# EAGLE design hall_sensor (EAGLE 7.5.0)
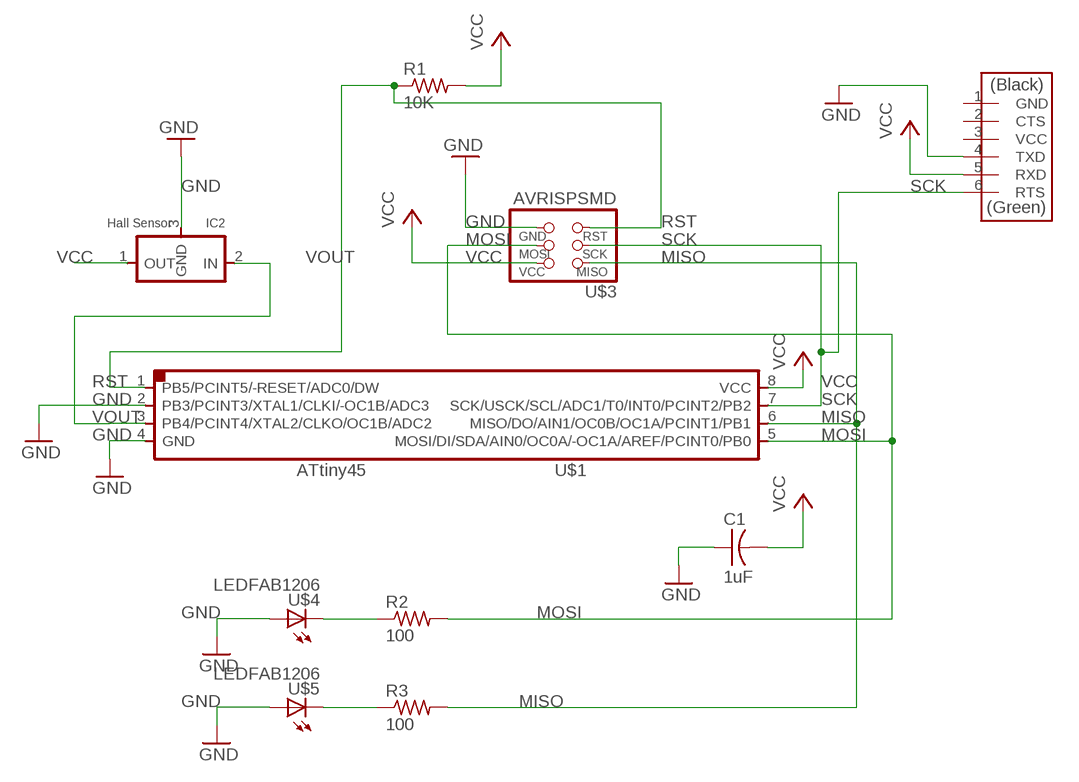
[diagram p0: schematic, sheet 1]

## Parts
C1  1uF  CAP-US1206FAB  [C1206FAB]
IC2  Hall Sensor  REGULATORSOT23  [SOT23]
R1  10K  RES-US1206FAB  [R1206FAB]
R2  100  RES-US1206FAB  [R1206FAB]
R3  100  RES-US1206FAB  [R1206FAB]
U$1  ATTINY45SI  [SOIC8]
U$2  FTDI-SMD-HEADER  [1X06SMD]
U$3  AVRISPSMD  [2X03SMD]
U$4  LEDFAB1206  [LED1206FAB]
U$5  LEDFAB1206  [LED1206FAB]

## Nets
GND: C1.1 IC2.3(GND) U$1.2(PB3/PCINT3/XTAL1/CLKI/-OC1B/ADC3) U$1.4(GND) U$2.4(TXD) U$3.6(GND) U$4.1(A) U$5.1(A)
MISO: R3.2 U$1.6(MISO/DO/AIN1/OC0B/OC1A/PCINT1/PB1) U$3.1(MISO)
MOSI: R2.2 U$1.5(MOSI/DI/SDA/AIN0/OC0A/-OC1A/AREF/PCINT0/PB0) U$3.4(MOSI)
N$1: R2.1 U$4.2(C)
N$2: R3.1 U$5.2(C)
RST: R1.1 U$1.1(PB5/PCINT5/-RESET/ADC0/DW) U$3.5(RST)
SCK: U$1.7(SCK/USCK/SCL/ADC1/T0/INT0/PCINT2/PB2) U$2.6(RTS) U$3.3(SCK)
VCC: C1.2 IC2.1(OUT) R1.2 U$1.8(VCC) U$2.5(RXD) U$3.2(VCC)
VOUT: IC2.2(IN) U$1.3(PB4/PCINT4/XTAL2/CLKO/OC1B/ADC2)
Unconnected: U$2.1(GND) U$2.2(CTS) U$2.3(VCC)

## Library data of the parts
C1 = fab (1):CAP-US
IC2 = fab (1):REGULATOR
R1-R3 = fab (1):RES-US: Resistor (US Symbol) Variants with postfix FAB are widened to allow the routing of internal traces
U$1 = fab (1):ATTINY45
U$2 = fab (1):FTDI-SMD-HEADER
U$3 = fab (1):AVRISP
U$4 U$5 = fab (1):LED: LED

## Board
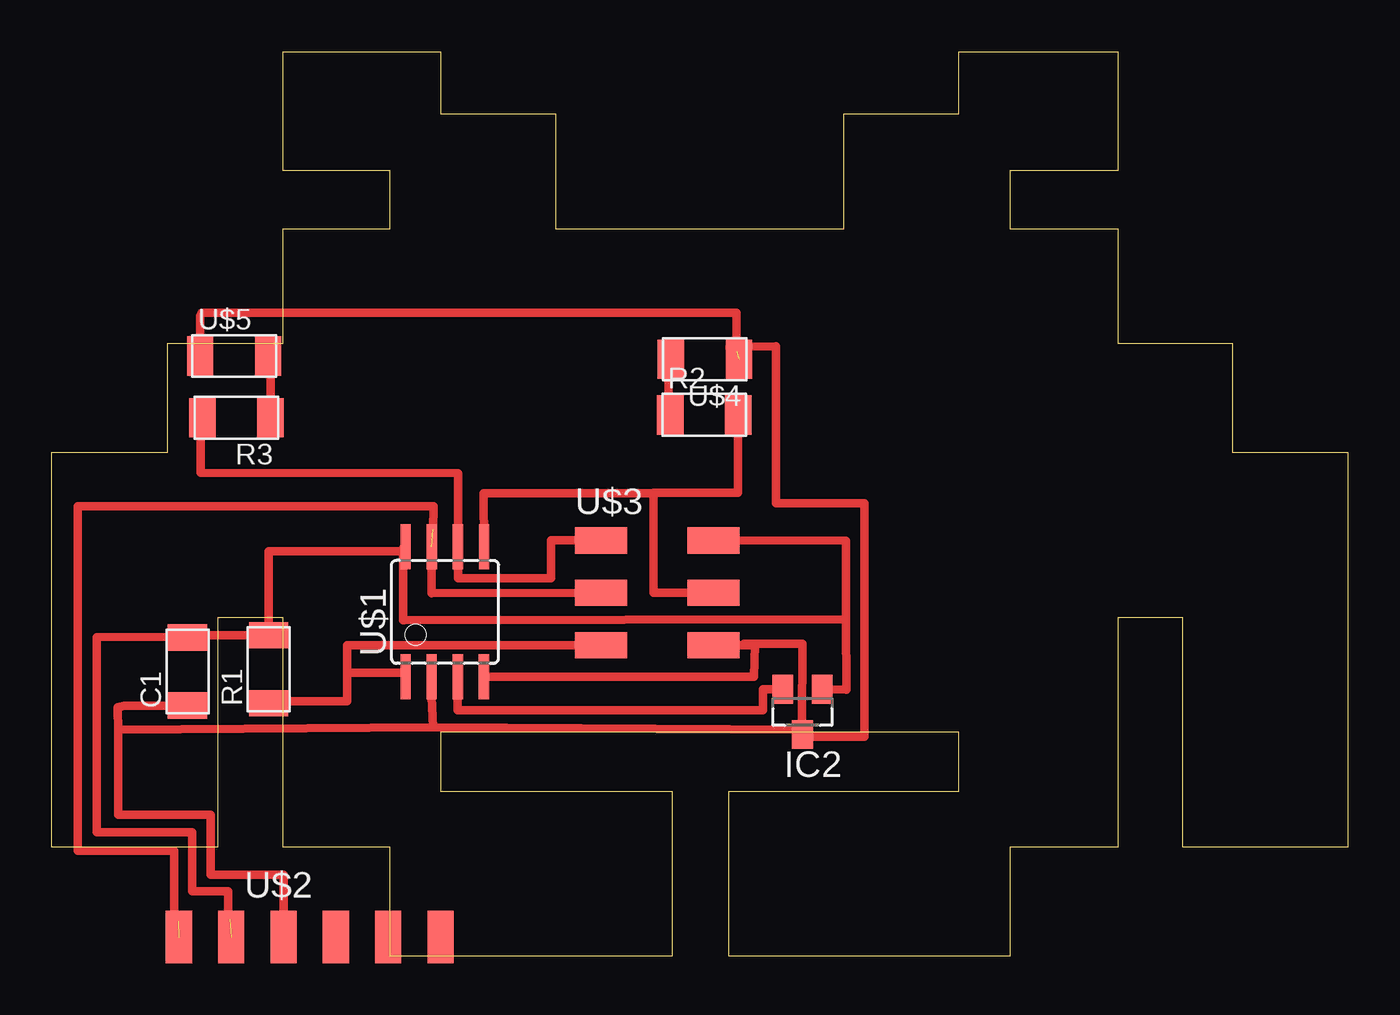
[diagram p1: board, top side]

Size 62.96 x 43.91 mm. Coordinates in mm from the lower left corner, seen from the top.
Outline: 16.45,5.27 11.24,5.27 11.24,16.41 8.06,16.41 8.06,5.27 0,5.27 0,24.45 5.65,24.45 5.65,29.75 11.24,29.75 11.24,35.31 16.45,35.31 16.45,38.13 11.24,38.13 11.24,43.91 18.89,43.91 18.89,40.89 24.48,40.89 24.48,35.31 38.48,35.31 38.48,40.89 44.07,40.89 44.07,43.91 51.78,43.91 51.78,38.13 46.55,38.13 46.55,35.31 51.78,35.31 51.78,29.75 57.34,29.75 57.34,24.45 62.96,24.45 62.96,5.27 54.93,5.27 54.93,16.41 51.78,16.41 51.78,5.27 46.55,5.27 46.55,0 32.89,0 32.89,8 44.07,8 44.07,10.86 18.89,10.86 18.89,8 30.13,8 30.13,0 16.45,0 16.45,5.27
Copper layers (1*16): Top 0.035mm / dielectric 1.5mm / Bottom 0.035mm
Design rules "default": minimum track width 10mil, minimum drill 24mil, track to track 8mil, track to pad 8mil, pad to pad 8mil, via to via 8mil, smd to smd 8mil, copper to edge 40mil, drill to drill 8mil, minimum pad ring 10mil, minimum via ring 8mil, stop-mask expansion 4mil, vias tented up to drill 0mil, thermal gap 10mil

### Footprints (pad centres in the part's own frame; a part is rotated, then mirrored left to right if it is on the bottom)
C1206FAB = smd 1.27 x 1.905: 1 -1.651,0; 2 1.651,0
SOT23 = smd 1 x 1.4: 1 -0.95,-1.1; 2 0.95,-1.1; 3 0,1.1
R1206FAB = smd 1.27 x 1.905: 1 -1.651,0; 2 1.651,0
SOIC8 = smd 0.5 x 2.2: 1 -1.905,-3.154; 2 -0.645,-3.154; 3 0.625,-3.154; 4 1.895,-3.154; 5 1.905,3.154; 6 0.635,3.154; 7 -0.635,3.154; 8 -1.905,3.154
1X06SMD = smd 2.54 x 1.27: 1 0,6.35; 2 0,3.81; 3 0,1.27; 4 0,-1.27; 5 0,-3.81; 6 0,-6.35
2X03SMD = smd 2.54 x 1.27: 1 -2.54,2.54; 2 2.92,2.54; 3 -2.54,0; 4 2.92,0; 5 -2.54,-2.54; 6 2.92,-2.54
LED1206FAB = smd 1.27 x 1.905: 1 -1.651,0; 2 1.651,0

### Placement (x,y rotation side)
C1  6.61,13.81 90 top
IC2  36.47,11.86 180 top
R1  10.55,13.92 90 top
R2  31.7,26.27 0 top
R3  8.98,26.13 180 top
U$1  19.1,16.71 0 top
U$2  12.54,0.92 270 top
U$3  29.22,17.63 0 top
U$4  31.73,28.97 180 top
U$5  8.88,29.13 0 top

### Tracks (layer width: path | path; a pad name or v marks a point on that pad's centre or on a via)
GND  (1 unrouted)
  Top 0.406: C1.1 6.45,12.15 3.54,12.15 3.23,12.07 3.24,10.9 | IC2.3 arc-90 36.45,11.23 36.46,15.15 33.62,15.15 33.62,15.09 | 33.62,15.09 34.15,15.09 34.11,13.56 U$1.4 | U$5.1 7.23,31.07 7.25,31.13 7.28,31.24 33.26,31.24 33.26,29.36 32.94,29.36 32.93,29.57 35.17,29.59 35.18,29.6 35.18,21.97 39.47,21.97 39.47,10.64 36.47,10.64 IC2.3 | 3.24,10.9 3.23,6.85 7.74,6.86 7.72,3.94 11.27,3.94 | 11.27,3.94 U$2.4 | 11.27,3.94 11.25,3.9 | U$1.2 18.42,13.56 18.53,11.1 | 18.53,11.1 36.58,10.99 IC2.3 | 18.53,11.1 3.24,10.99 3.24,10.9 | 33.62,15.09 U$3.6
MISO
  Top 0.406: R3.2 arc90 7.24,26.37 7.24,23.46 19.74,23.43 arc90 19.74,23.38 U$1.6 19.74,18.35 19.75,18.35 19.75,18.33 24.26,18.33 24.26,20.17 U$3.1
MOSI
  Top 0.406: U$3.4 29.22,17.63 29.22,22.48 | 29.22,22.48 29.2,22.46 20.98,22.46 U$1.5 | R2.2 arc-90 33.34,26.06 33.34,22.48 29.22,22.48
N$1
  Top 0.406: U$4.2 29.96,28.97 29.96,25.69 30.05,25.69 R2.1
N$2
  Top 0.406: U$5.2 10.58,29.35 10.58,28.76 10.63,28.71 R3.1
RST
  Top 0.406: U$3.5 14.36,15.09 14.36,13.75 | 14.36,13.75 17.2,13.75 U$1.1 | R1.1 11.59,12.38 14.35,12.38 14.35,13.56 14.36,13.56 14.36,13.75
SCK  (2 unrouted)
  Top 0.406: U$3.3 18.46,17.62 U$1.7 | 18.53,20.7 18.55,21.85 1.28,21.85 1.28,5.1 5.69,5.1 5.97,5.12 5.97,1.99 6.16,1.99 6.16,1.7
VCC  (1 unrouted)
  Top 0.406: 37.43,12.95 IC2.1 38.59,12.93 38.57,16.34 | 38.57,16.34 38.58,20.16 U$3.2 arc-90 32.29,20.32 32.42,20.32 | 38.57,16.34 17.12,16.3 arc90 17.08,16.31 17.06,19.73 arc-90 U$1.8 17.02,19.66 10.57,19.66 10.56,19.64 R1.2 7.45,15.56 6.53,15.5 | 6.53,15.5 2.2,15.47 2.2,6 6.82,6 6.83,3.14 8.59,3.14 8.59,1.78 8.65,1.78 | 6.53,15.5 C1.2
VOUT
  Top 0.406: IC2.2 34.56,12.96 34.56,11.92 19.73,11.92 U$1.3